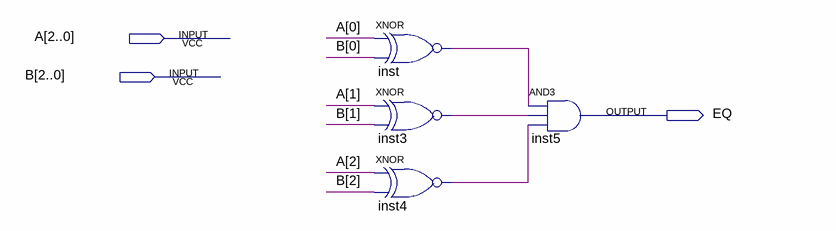
[diagram p0: schematic sheet]
// Quartus schematic cmp.bdf as structural Verilog: 4 symbols, 3 pins
module cmp (
  input  [2:0] A,
  input  [2:0] B,
  output EQ
);

  wire inst3_out, inst4_out, inst_out;

  xnor inst (inst_out, A[0], B[0]);
  xnor inst3 (inst3_out, A[1], B[1]);
  xnor inst4 (inst4_out, A[2], B[2]);
  and inst5 (EQ, inst_out, inst3_out, inst4_out);
endmodule
